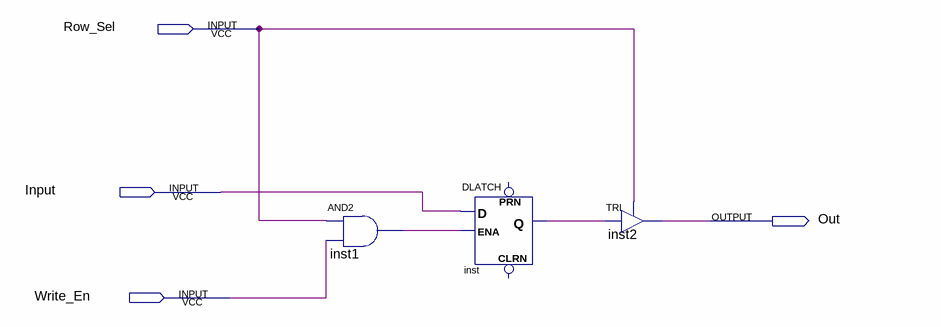
[diagram p0: schematic sheet]
// Quartus schematic MemoryCell.bdf as structural Verilog: 3 symbols, 4 pins
module MemoryCell (
  input  Row_Sel,
  input  Input,
  input  Write_En,
  output Out
);

  wire inst1_out, inst_q;

  and inst1 (inst1_out, Row_Sel, Write_En);
  DLATCH inst (.D(Input), .ENA(inst1_out), .Q(inst_q));  // open: CLRN, PRN
  TRI inst2 (.IN(inst_q), .OE(Row_Sel), .OUT(Out));
endmodule
